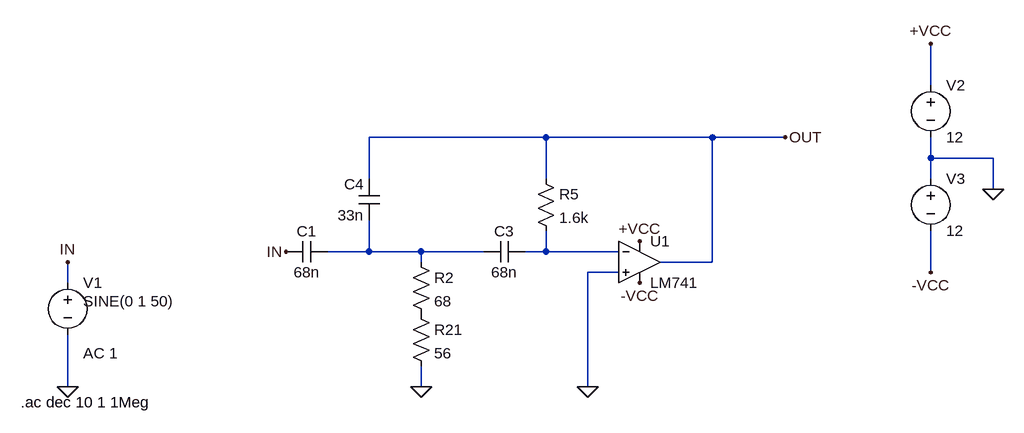
[diagram p0: schematic MFB-HighPass.asc]
MFB-HighPass.asc, the LTspice schematic file:
Version 4
SHEET 1 1296 680
WIRE 896 -176 896 -240
WIRE 304 -96 32 -96
WIRE 560 -96 304 -96
WIRE 672 -96 560 -96
WIRE 896 -64 896 -96
WIRE 992 -64 896 -64
WIRE 32 -32 32 -96
WIRE 304 -32 304 -96
WIRE 896 -32 896 -64
WIRE 992 -16 992 -64
WIRE 32 80 32 32
WIRE 32 80 -32 80
WIRE 112 80 32 80
WIRE 208 80 112 80
WIRE 304 80 304 48
WIRE 304 80 272 80
WIRE 416 80 304 80
WIRE 112 96 112 80
WIRE 560 96 560 -96
WIRE 560 96 480 96
WIRE 416 112 368 112
WIRE 896 112 896 48
WIRE -432 128 -432 96
WIRE -432 288 -432 208
WIRE 112 288 112 256
WIRE 368 288 368 112
FLAG 112 288 0
FLAG 368 288 0
FLAG 992 -16 0
FLAG 896 112 -VCC
FLAG 448 128 -VCC
FLAG 896 -240 +VCC
FLAG 448 64 +VCC
FLAG -432 288 0
FLAG -96 80 IN
FLAG -432 96 IN
FLAG 672 -96 OUT
SYMBOL cap -32 64 R90
WINDOW 0 0 32 VBottom 2
WINDOW 3 32 32 VTop 2
SYMATTR InstName C1
SYMATTR Value 68n
SYMBOL cap 48 32 R180
WINDOW 0 24 56 Left 2
WINDOW 3 24 8 Left 2
SYMATTR InstName C4
SYMATTR Value 33n
SYMBOL cap 208 96 R270
WINDOW 0 32 32 VTop 2
WINDOW 3 0 32 VBottom 2
SYMATTR InstName C3
SYMATTR Value 68n
SYMBOL res 96 80 R0
SYMATTR InstName R2
SYMATTR Value 68
SYMBOL res 288 -48 R0
SYMATTR InstName R5
SYMATTR Value 1.6k
SYMBOL res 96 160 R0
SYMATTR InstName R21
SYMATTR Value 56
SYMBOL voltage -432 112 R0
WINDOW 123 24 124 Left 2
WINDOW 39 0 0 Left 0
WINDOW 3 24 44 Left 2
SYMATTR Value2 AC 1
SYMATTR InstName V1
SYMATTR Value SINE(0 1 50)
SYMBOL voltage 896 -192 R0
WINDOW 123 0 0 Left 0
WINDOW 39 0 0 Left 0
SYMATTR InstName V2
SYMATTR Value 12
SYMBOL voltage 896 -48 R0
WINDOW 123 0 0 Left 0
WINDOW 39 0 0 Left 0
SYMATTR InstName V3
SYMATTR Value 12
SYMBOL OpAmps\\LM741 448 32 R0
SYMATTR InstName U1
TEXT -504 312 Left 2 !.ac dec 10 1 1Meg

The netlist it stands for:
* MFB-HighPass.asc
C1 N001 IN 68n
C4 N001 OUT 33n
C3 N001 N002 68n
R2 N001 P001 68
R5 OUT N002 1.6k
R21 P001 0 56
V1 IN 0 SINE(0 1 50) AC 1
V2 +VCC 0 12
V3 0 -VCC 12
XU1 0 N002 +VCC -VCC OUT LM741  ; pins In+ In- V+ V- OUT
.ac dec 10 1 1Meg
.lib LM741.lib
.backanno
.end